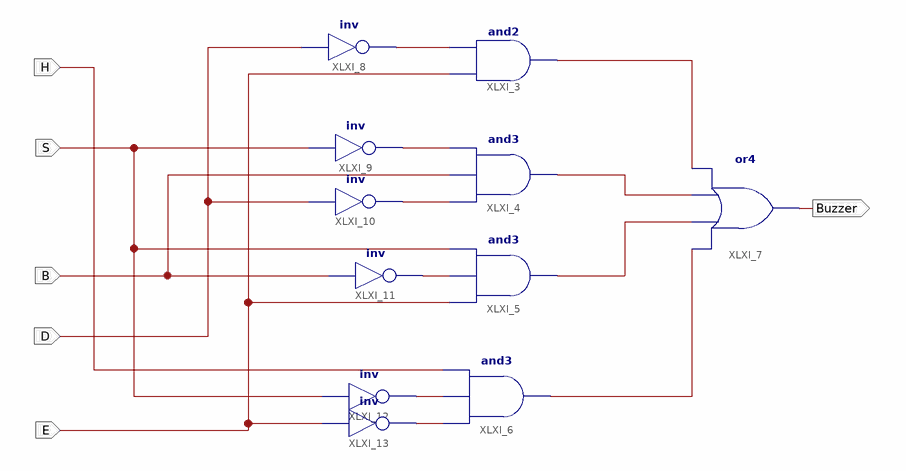
[diagram p0: schematic sheet 1]
// Xilinx ISE schematic carState.sch (spartan6) as structural Verilog: 11 symbols, 6 ports
module carState (
  input  H,
  input  S,
  input  B,
  input  D,
  input  E,
  output Buzzer
);

  wire XLXN_5, XLXN_6, XLXN_7, XLXN_8, XLXN_24, XLXN_25, XLXN_26, XLXN_27, XLXN_28, XLXN_29;

  and XLXI_3 (XLXN_5, E, XLXN_24);
  and XLXI_4 (XLXN_6, XLXN_26, B, XLXN_25);
  and XLXI_5 (XLXN_7, E, XLXN_27, S);
  and XLXI_6 (XLXN_8, XLXN_29, XLXN_28, H);
  or XLXI_7 (Buzzer, XLXN_8, XLXN_7, XLXN_6, XLXN_5);
  not XLXI_8 (XLXN_24, D);
  not XLXI_9 (XLXN_25, S);
  not XLXI_10 (XLXN_26, D);
  not XLXI_11 (XLXN_27, B);
  not XLXI_12 (XLXN_28, S);
  not XLXI_13 (XLXN_29, E);
endmodule
